# Altium schematic sheet logique_hardware.SchDoc: Projet M1 2024
size A4; DrawnBy: J.CLEMENT & D.FOURNIER; Revision: V1.0 Rev A; SheetNumber: 4; SheetTotal: 7
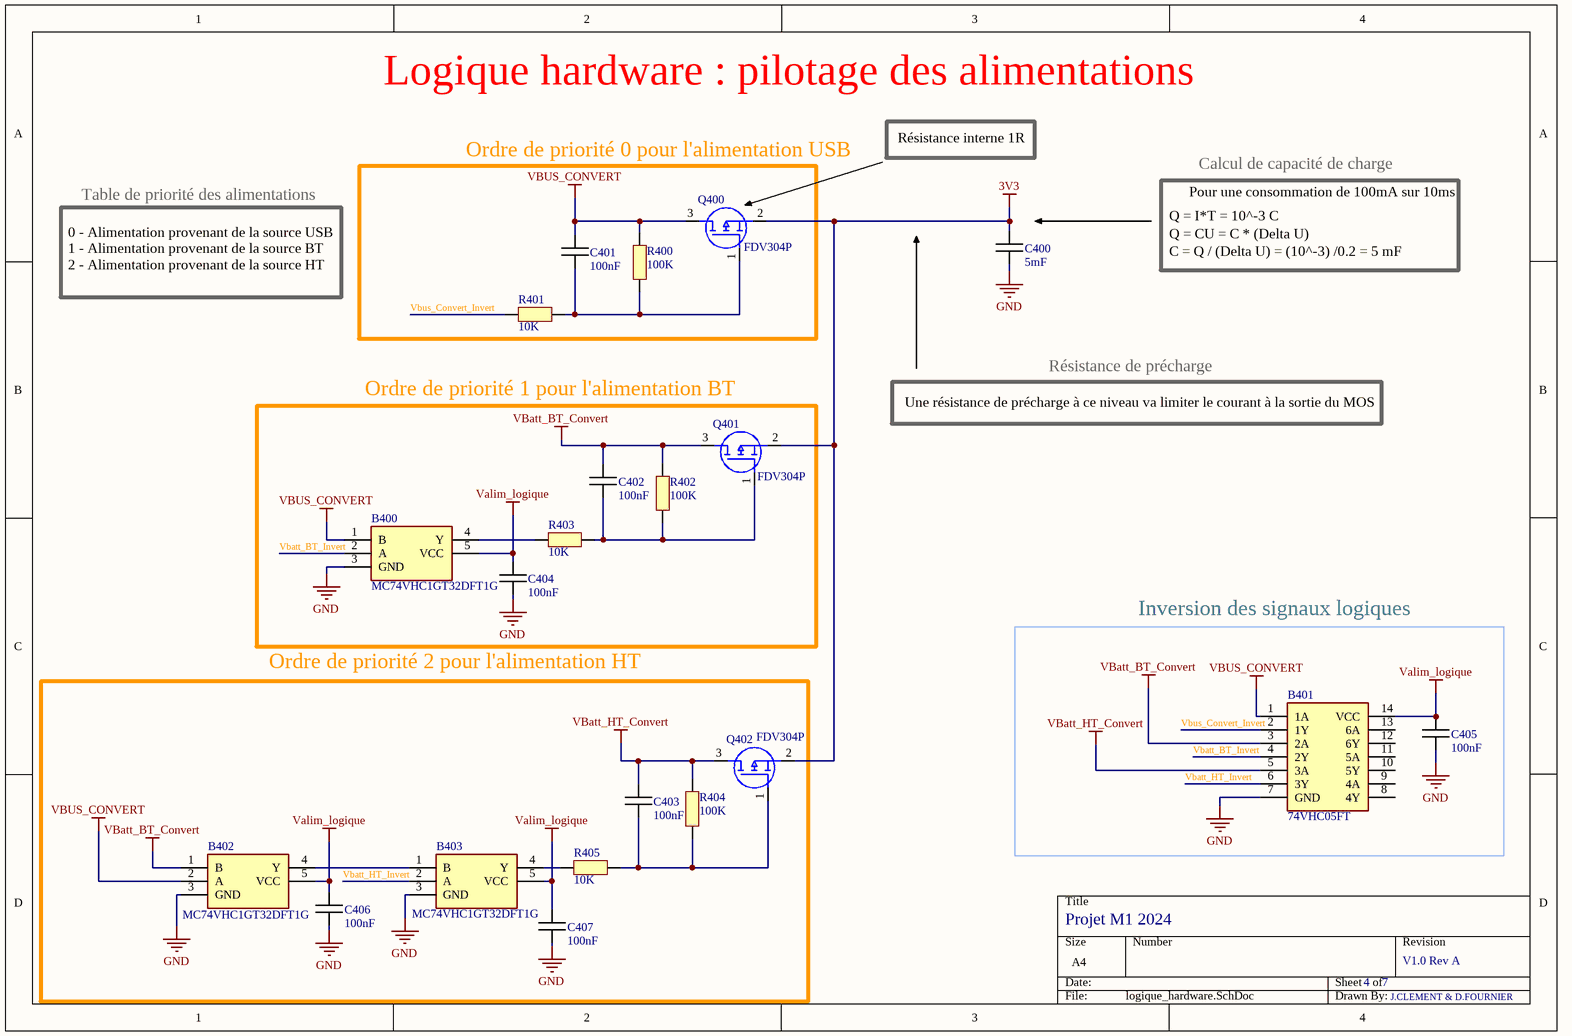
[diagram p0: logique_hardware.SchDoc]

## Parts
B400  MC74VHC1GT32DFT1G  [SOT65P210X110-5N]
B401  74VHC05FT  [SOP65P640X120-14N]
B402  MC74VHC1GT32DFT1G  [SOT65P210X110-5N]
B403  MC74VHC1GT32DFT1G  [SOT65P210X110-5N]
C400  5mF  [CAPA_0603]
C401  100nF  [CAPA_0603]
C402  100nF  [CAPA_0603]
C403  100nF  [CAPA_0603]
C404  100nF  [CAPA_0603]
C405  100nF  [CAPA_0603]
C406  100nF  [CAPA_0603]
C407  100nF  [CAPA_0603]
Q400  FDV304P  [SOT95P251X112-3N]
Q401  FDV304P  [SOT95P251X112-3N]
Q402  FDV304P  [SOT95P251X112-3N]
R400  100K  [RES_0603]
R401  10K  [RES_0603]
R402  100K  [RES_0603]
R403  10K  [RES_0603]
R404  100K  [RES_0603]
R405  10K  [RES_0603]

## Blocks framed on the sheet
Ordre de priorité 0 pour l'alimentation USB: C401 Q400 R400 R401
Ordre de priorité 1 pour l'alimentation BT: B400 C402 C404 Q401 R402 R403
Inversion des signaux logiques: B401 C405
Ordre de priorité 2 pour l'alimentation HT: B402 B403 C403 C406 C407 Q402 R404 R405

## Nets
3V3: C400.1 Q400.2(S) Q401.2(S) Q402.2(S)
GND: B400.3(GND) B401.7(GND) B402.3(GND) B403.3(GND) C400.2 C404.2 C405.2 C406.2 C407.2
Valim_logique: B400.5(VCC) B401.14(VCC) B402.5(VCC) B403.5(VCC) C404.1 C405.1 C406.1 C407.1
VBatt_BT_Convert: B401.3(2A) B402.1(B) C402.1 Q401.3(D) R402.2
VBatt_HT_Convert: B401.5(3A) C403.1 Q402.3(D) R404.2
VBUS_CONVERT: B400.1(B) B401.1(1A) B402.2(A) C401.1 Q400.3(D) R400.2
Vbatt_BT_Invert: B400.2(A) B401.4(2Y)
Vbatt_HT_Invert: B401.6(3Y) B403.2(A)
Vbus_Convert_Invert: B401.2(1Y) R401.1
NetB400_4: B400.4(Y) R403.1
NetB402_4: B402.4(Y) B403.1(B)
NetB403_4: B403.4(Y) R405.1
NetC401_2: C401.2 Q400.1(G) R400.1 R401.2
NetC402_2: C402.2 Q401.1(G) R402.1 R403.2
NetC403_2: C403.2 Q402.1(G) R404.1 R405.2

Not connected (* = marked no-connect by the designer): B401 8(4Y) 9(4A) 10(5Y) 11(5A) 12(6Y) 13(6A)

## Notes on the sheet
- Logique hardware : pilotage des alimentations
- Résistance interne 1R
- Calcul de capacité de charge
- 0 - Alimentation provenant de la source USB
- Table de priorité des alimentations
- Q = I*T = 10^-3 C
- Q = CU = C * (Delta U)
- Pour une consommation de 100mA sur 10ms
- 1 - Alimentation provenant de la source BT
- 2 - Alimentation provenant de la source HT
- C = Q / (Delta U) = (10^-3) /0.2 = 5 mF
- Résistance de précharge
- Une résistance de précharge à ce niveau va limiter le courant à la sortie du MOS

## Library data of the parts
B400 B402 B403 = MC74VHC1GT32DFT1G: Single 2-Input OR Gate, TTL Level; Manufacturer_Name: onsemi; Manufacturer_Part_Number: MC74VHC1GT32DFT1G; Mouser Part Number: 863-C74VHC1GT32DFT1G
B401 = 74VHC05FT: Logic Gates CMOS LOGIC IC INVERTER; Manufacturer_Name: Toshiba; Manufacturer_Part_Number: 74VHC05FT; Mouser Part Number: 757-74VHC05FT
C400-C407 = Capacitor
Q400-Q402 = FDV304P: ON SEMICONDUCTOR - FDV304P - Power MOSFET, P Channel, 25 V, 460 mA, 1.22 ohm, SOT-23, Surface Mount; Manufacturer_Name: onsemi; Geometry.Height: 1.12mm; Manufacturer_Part_Number: FDV304P; Mouser Part Number: 512-FDV304P; Mouser Price/Stock: https://www.mouser.co.uk/ProductDetail/onsemi-Fairchild/FDV304P?qs=FOlmdCx%252BAA1BAlCQZu888w%3D%3D; Arrow Part Number: FDV304P; Arrow Price/Stock: https://www.arrow.com/en/products/fdv304p/on-semiconductor?utm_currency=USD&region=europe; Datasheet Link: https://componentsearchengine.com/Datasheets/2/FDV304P.pdf
R400-R405 = Resistor